# EAGLE design driver_gliderscore (EAGLE 7.5.0)

## Sheet 1 of 2
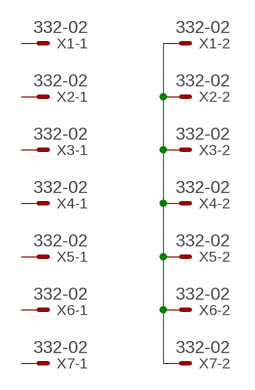
[diagram p0: schematic, sheet 1]

### Parts
X1  332-02  [332-02]
X2  332-02  [332-02]
X3  332-02  [332-02]
X4  332-02  [332-02]
X5  332-02  [332-02]
X6  332-02  [332-02]
X7  332-02  [332-02]

### Nets
N$11: X1.2 X2.2 X3.2 X4.2 X5.2 X6.2 X7.2
Unconnected: X1.1 X2.1 X3.1 X4.1 X5.1 X6.1 X7.1

## Sheet 2 of 2
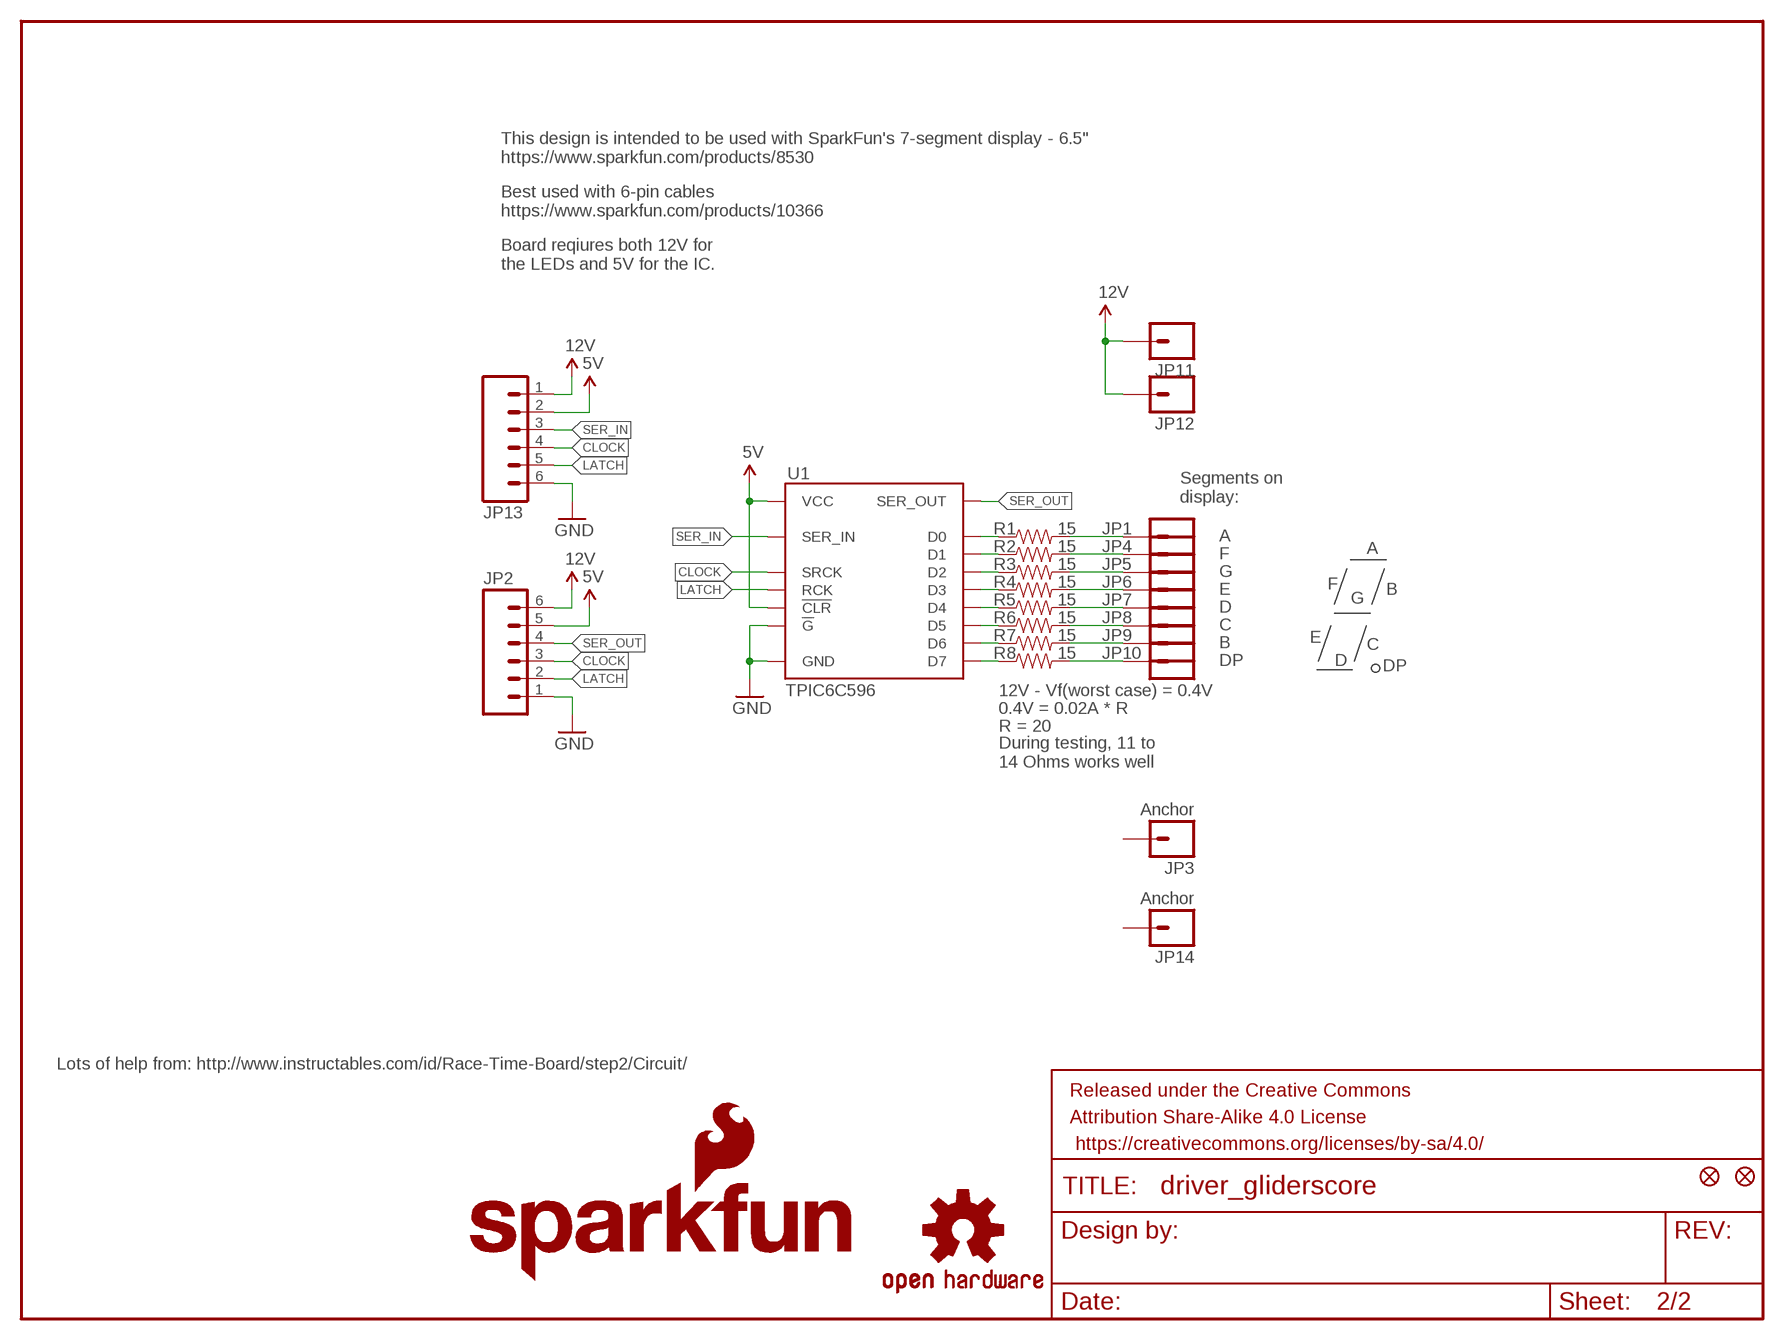
[diagram p1: schematic, sheet 2]

### Parts
FID1  FIDUCIAL1X2  [FIDUCIAL-1X2]
FID2  FIDUCIAL1X2  [FIDUCIAL-1X2]
FRAME1  FRAME-LETTER  [CREATIVE_COMMONS]
JP1  M01PTH_LONGPAD  [1X01_LONGPAD]
JP2  M06SMD  [1X06-SMD]
JP3  Anchor  M01PTH_LONGPAD  [1X01_LONGPAD]
JP4  M01PTH_LONGPAD  [1X01_LONGPAD]
JP5  M01PTH_LONGPAD  [1X01_LONGPAD]
JP6  M01PTH_LONGPAD  [1X01_LONGPAD]
JP7  M01PTH_LONGPAD  [1X01_LONGPAD]
JP8  M01PTH_LONGPAD  [1X01_LONGPAD]
JP9  M01PTH_LONGPAD  [1X01_LONGPAD]
JP10  M01PTH_LONGPAD  [1X01_LONGPAD]
JP11  M01PTH_LONGPAD  [1X01_LONGPAD]
JP12  M01PTH_LONGPAD  [1X01_LONGPAD]
JP13  M06SMD  [1X06-SMD]
JP14  Anchor  M01PTH_LONGPAD  [1X01_LONGPAD]
LOGO1  SFE_LOGO_NAME_FLAME.1_INCH  [SFE_LOGO_NAME_FLAME_.1]
LOGO2  OSHW-LOGOS  [OSHW-LOGO-S]
R1  15  15OHM-1/10W-1%(0603)0603  [0603-RES]
R2  15  15OHM-1/10W-1%(0603)0603  [0603-RES]
R3  15  15OHM-1/10W-1%(0603)0603  [0603-RES]
R4  15  15OHM-1/10W-1%(0603)0603  [0603-RES]
R5  15  15OHM-1/10W-1%(0603)0603  [0603-RES]
R6  15  15OHM-1/10W-1%(0603)0603  [0603-RES]
R7  15  15OHM-1/10W-1%(0603)0603  [0603-RES]
R8  15  15OHM-1/10W-1%(0603)0603  [0603-RES]
U1  TPIC6C596  TPIC6C596SOIC  [SO016]

### Nets
5V: JP2.5 JP13.2 U1.1(VCC) U1.7(!CLR)
12V: JP2.6 JP11.1 JP12.1 JP13.1
CLOCK: JP2.3 JP13.4 U1.15(SRCK)
D0: R1.1 U1.3(D0)
D1: R2.1 U1.4(D1)
D2: R3.1 U1.5(D2)
D3: R4.1 U1.6(D3)
D4: R5.1 U1.11(D4)
D5: R6.1 U1.12(D5)
D6: R7.1 U1.13(D6)
D7: R8.1 U1.14(D7)
GND: JP2.1 JP13.6 U1.8(!G) U1.16(GND)
LATCH: JP2.2 JP13.5 U1.10(RCK)
S0: JP1.1 R1.2
S1: JP4.1 R2.2
S2: JP5.1 R3.2
S3: JP6.1 R4.2
S4: JP7.1 R5.2
S5: JP8.1 R6.2
S6: JP9.1 R7.2
S7: JP10.1 R8.2
SER_IN: JP13.3 U1.2(SER_IN)
SER_OUT: JP2.4 U1.9(SER_OUT)
Unconnected: JP3.1 JP14.1

### Notes on the sheet
- This design is intended to be used with SparkFun's 7-segment display - 6.5"
  https://www.sparkfun.com/products/8530
- Best used with 6-pin cables
  https://www.sparkfun.com/products/10366
- Board reqiures both 12V for 
  the LEDs and 5V for the IC.
- Segments on
  display:
- A
- A
- F
- G
- F
- E | B
- G
- D
- C
- E
- B | C
- DP | D
- DP
- 12V - Vf(worst case) = 0.4V
- 0.4V = 0.02A * R
- R = 20
- During testing, 11 to 
  14 Ohms works well
- Lots of help from: http://www.instructables.com/id/Race-Time-Board/step2/Circuit/

## Library data of the parts
FID1 FID2 = SparkFun-Aesthetics:FIDUCIAL: Fiducial Alignment Points Various fiducial points for machine vision alignment.
FRAME1 = SparkFun-Aesthetics:FRAME-LETTER: Schematic Frame Standard 8.5x11 US Letter frame; DESIGNER: N. Seidle; VERSION: v10
JP1 JP3-JP12 JP14 = SparkFun-Connectors:M01: Header 1 Standard 1-pin 0.1" header. Use with straight break away headers (SKU : PRT-00116), right angle break away headers (PRT-00553), swiss pins (PRT-00743), machine pins (PRT-00117), and female headers (PRT-00115).
JP2 JP13 = SparkFun-Connectors:M06: Header 6 Standard 6-pin 0.1" header. Use with straight break away headers (SKU : PRT-00116), right angle break away headers (PRT-00553), swiss pins (PRT-00743), machine pins (PRT-00117), and female headers (PRT-00115). Molex polarized connector foot print use with SKU : PRT-08094 with associated crimp pins and housings. NOTES ON THE VARIANTS LOCK and LOCK_LONGPADS... This footprint was designed to help hold the alignment of a through-hole component (i.e. 6-pin header) while soldering it into place. You may notice that each hole has been shifted either up or down by 0.005 of an inch from it's more standard position (which is a perfectly straight line). This slight alteration caused the pins (the squares in the middle) to touch the edges of the holes. Because they are alternating, it causes a "brace" to hold the component in place. 0.005 has proven to be the perfect amount of "off-center" position when using our standard breakaway headers. Although looks a little odd when you look at the bare footprint, once you have a header in there, the alteration is very hard to notice. Also,if you push a header all the way into place, it is covered up entirely on the bottom side. This idea of altering the position of holes to aid alignment will be further integrated into the Sparkfun Library for other footprints. It can help hold any component with 3 or more connection pins.; PROD_ID: CONN-08971; VALUE: RA 6Pin SMD
LOGO1 = SparkFun-Aesthetics:SFE_LOGO_NAME_FLAME: SFE Logo, name and flame This is the SparkFun full logo. The logo on the schematic will always be the same size; the package variant is the height of the flame part of the logo. Default layer for the logo on the board is tSilk.
LOGO2 = SparkFun-Aesthetics:OSHW-LOGO: Open Source Hardware Logo This logo indicates the piece of hardware it is found on incorporates a OSHW license and/or adheres to the definition of open source hardware found here: http://freedomdefined.org/OSHW
R1-R8 = SparkFun-Resistors:15OHM-1/10W-1%(0603); PROD_ID: RES-12570
U1 = SparkFun-DigitalIC:TPIC6C596: SMD version of the popular sink driver. This version can sink up to 100mA per channel; PROD_ID: IC-12522
X1-X7 = con-garry:332-02: 2 Pin - 2mm Dual Row Source: www.mpe-connector.de / garry_shortform_2012.pdf

## Board
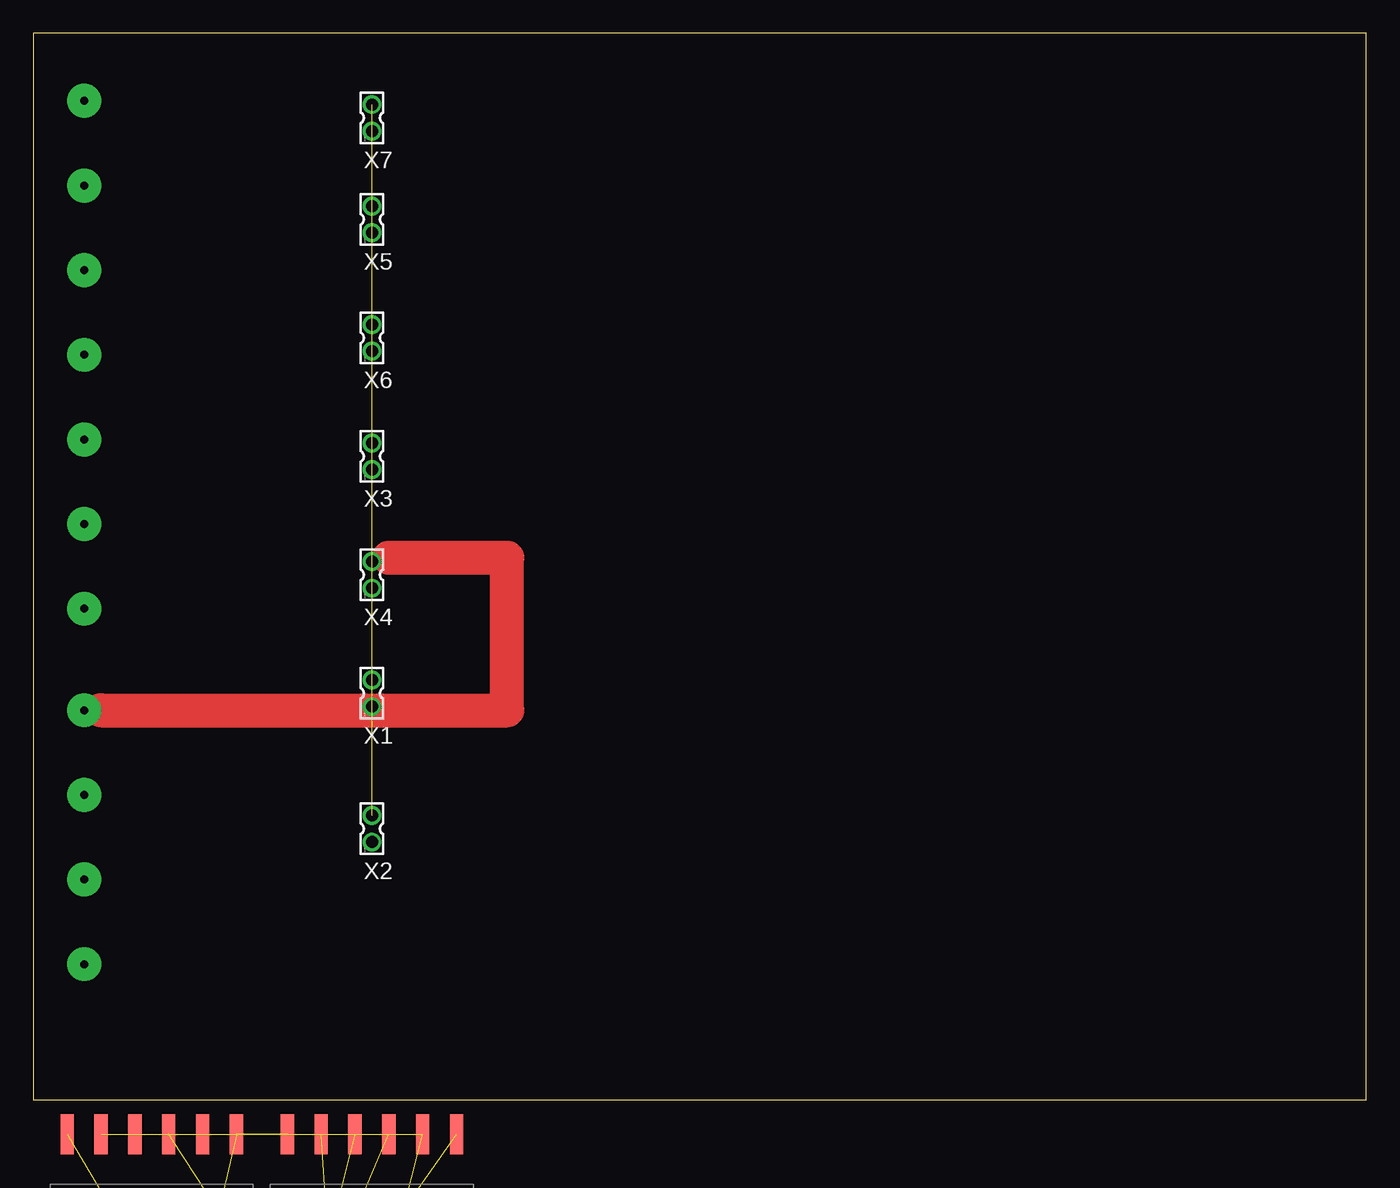
[diagram p2: board, top side]
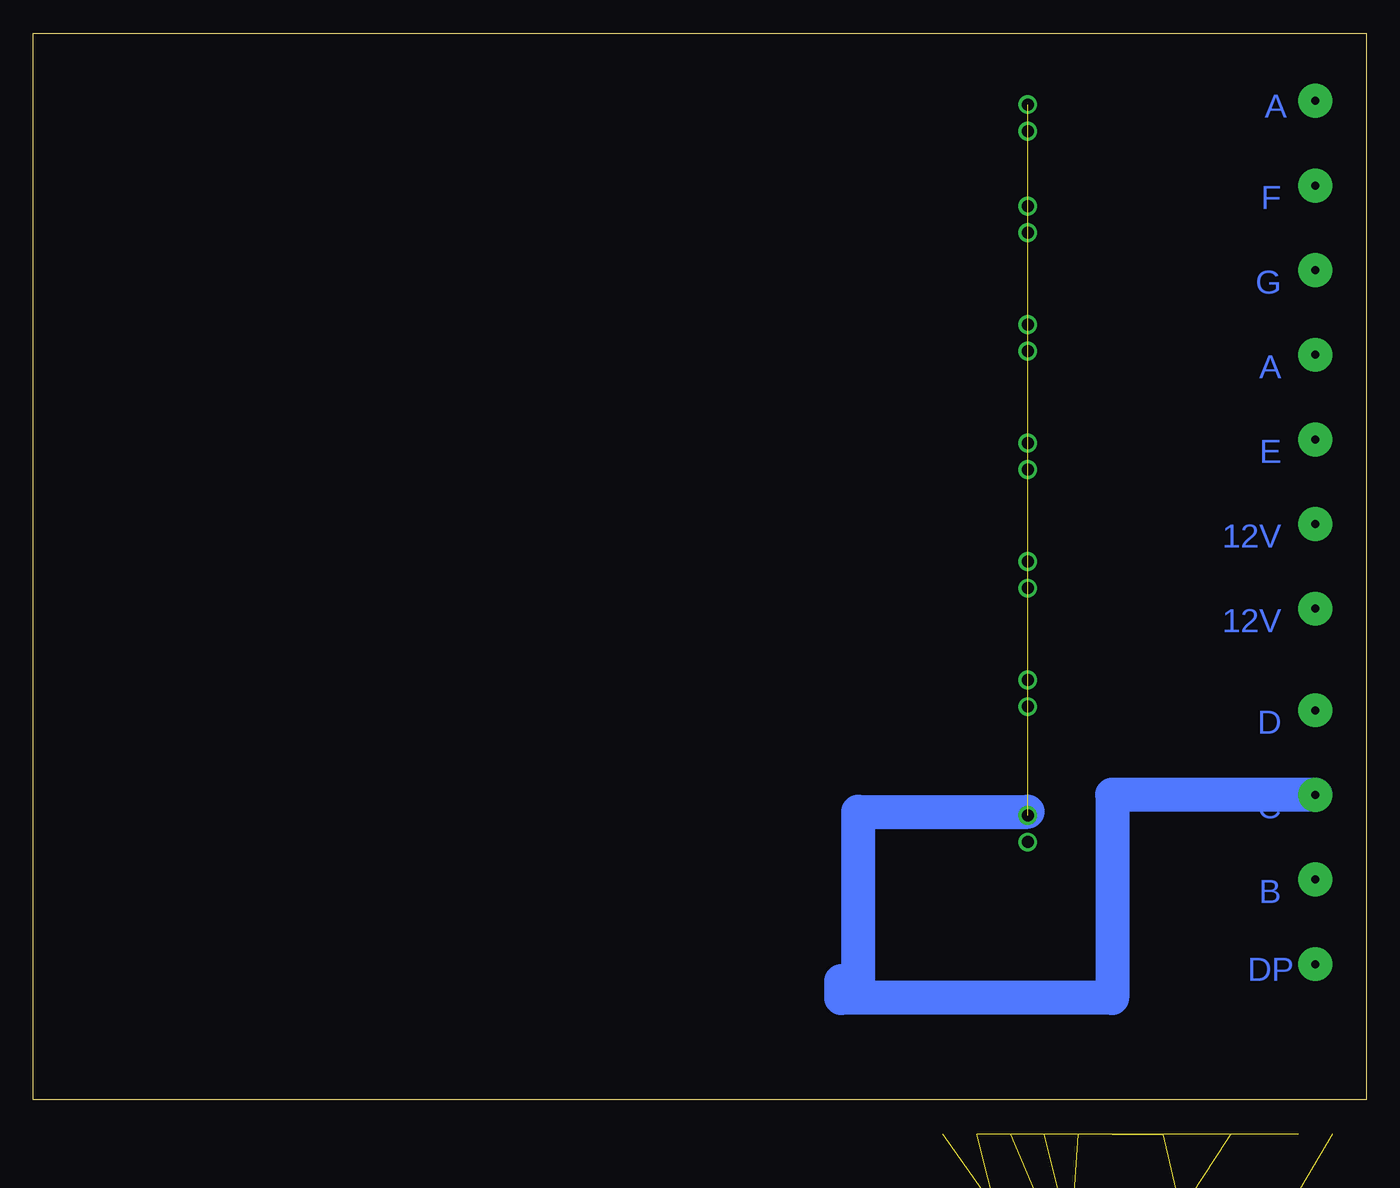
[diagram p3: board, bottom side, seen from below]

Size 100 x 80 mm. Coordinates in mm from the lower left corner, seen from the top.
Outline: 0,0 100,0 100,80 0,80 0,0
Copper layers (1*16): Top 0.035mm / dielectric 1.5mm / Bottom 0.035mm
Design rules "default": minimum track width 10mil, minimum drill 24mil, track to track 8mil, track to pad 8mil, pad to pad 8mil, via to via 8mil, smd to smd 8mil, copper to edge 40mil, drill to drill 8mil, minimum pad ring 10mil, minimum via ring 8mil, stop-mask expansion 4mil, vias tented up to drill 0mil, thermal gap 10mil

### Footprints (pad centres in the part's own frame; a part is rotated, then mirrored left to right if it is on the bottom)
FIDUCIAL-1X2 = smd 1 x 1: 1 0,0
1X01_LONGPAD = drill 1.118 pad 1.88 long: 1 0,0
1X06-SMD = smd 1 x 3: 1 -6.35,5; 2 -3.81,5; 3 -1.27,5; 4 1.27,5; 5 3.81,5; 6 6.35,5 | hole 1.4: -5.08,0; 5.08,0
0603-RES = smd 1.1 x 1: 1 -0.85,0; 2 0.85,0
SO016 = smd 0.6 x 1.2: 1 -4.445,-2.8; 2 -3.175,-2.8; 3 -1.905,-2.8; 4 -0.635,-2.8; 5 0.635,-2.8; 6 1.905,-2.8; 7 3.175,-2.8; 8 4.445,-2.8; 9 4.445,2.8; 10 3.175,2.8; 11 1.905,2.8; 12 0.635,2.8; 13 -0.635,2.8; 14 -1.905,2.8; 15 -3.175,2.8; 16 -4.445,2.8
332-02 = drill 0.9 pad 1.27: 1 0,-1; 2 0,1

### Placement (x,y rotation side)
FID1  29.21,-39.37 0 top  (outside the outline)
FID2  31.75,-39.37 0 top  (outside the outline)
FRAME1  21.59,-22.86 0 top  (outside the outline)
JP1  12.7,-35.56 0 top  (outside the outline)
JP2  8.89,-7.62 0 top
JP3  2.54,-27.94 0 top  (outside the outline)
JP4  16.51,-35.56 0 top  (outside the outline)
JP5  20.32,-35.56 0 top  (outside the outline)
JP6  24.13,-35.56 0 top  (outside the outline)
JP7  27.94,-35.56 0 top  (outside the outline)
JP8  31.75,-35.56 0 top  (outside the outline)
JP9  35.56,-35.56 0 top  (outside the outline)
JP10  41.91,-27.94 0 top  (outside the outline)
JP11  2.54,-35.56 0 top  (outside the outline)
JP12  7.62,-35.56 0 top  (outside the outline)
JP13  25.4,-7.62 0 top
JP14  10.16,-27.94 0 top  (outside the outline)
LOGO1  27.94,-29.21 0 top  (outside the outline)
LOGO2  25.4,-39.37 0 top  (outside the outline)
R1  39.37,-33.02 0 top  (outside the outline)
R2  43.18,-33.02 0 top  (outside the outline)
R3  2.54,-39.37 0 top  (outside the outline)
R4  6.35,-39.37 0 top  (outside the outline)
R5  10.16,-39.37 0 top  (outside the outline)
R6  13.97,-39.37 0 top  (outside the outline)
R7  17.78,-39.37 0 top  (outside the outline)
R8  21.59,-39.37 0 top  (outside the outline)
U1  20.32,-27.94 0 top  (outside the outline)
X1  25.4,30.48 0 top
X2  25.4,20.32 0 top
X3  25.4,48.26 0 top
X4  25.4,39.37 0 top
X5  25.4,66.04 0 top
X6  25.4,57.15 0 top
X7  25.4,73.66 0 top

### Tracks (layer width: path | path; a pad name or v marks a point on that pad's centre or on a via)
5V  (3 unrouted)
12V  (3 unrouted)
A  (via drill 0.6 pad 2.54)
  other vias: 3.81,74.93
CLOCK  (2 unrouted)
D0  (1 unrouted)
D1  (1 unrouted)
D2  (1 unrouted)
D3  (1 unrouted)
D4  (1 unrouted)
D5  (1 unrouted)
D6  (1 unrouted)
D7  (1 unrouted)
F  (via drill 0.6 pad 2.54)
  other vias: 3.81,68.58
GND  (3 unrouted)
LATCH  (2 unrouted)
N$1  (via drill 0.6 pad 2.54)
  other vias: 3.81,10.16
N$2
  Top 2.54: 5.08,29.21 35.56,29.21 35.56,40.64 26.67,40.64
N$3  (via drill 0.6 pad 2.54)
  other vias: 3.81,62.23
N$4  (via drill 0.6 pad 2.54)
  other vias: 3.81,55.88
N$5  (via drill 0.6 pad 2.54)
  other vias: 3.81,49.53
N$6  (via drill 0.6 pad 2.54)
  other vias: 3.81,43.18
N$7  (via drill 0.6 pad 2.54)
  other vias: 3.81,36.83
N$8  (via drill 0.6 pad 2.54)
  other vias: 3.81,29.21
N$9  (via drill 0.6 pad 2.54)
  Bottom 2.54: v3.81,22.86 19.05,22.86 19.05,7.62 39.37,7.62 39.37,8.89 38.1,8.89 38.1,21.59 25.4,21.59
N$10  (via drill 0.6 pad 2.54)
  other vias: 3.81,16.51
N$11  (6 unrouted)
S0  (1 unrouted)
S1  (1 unrouted)
S2  (1 unrouted)
S3  (1 unrouted)
S4  (1 unrouted)
S5  (1 unrouted)
S6  (1 unrouted)
S7  (1 unrouted)
SER_IN  (1 unrouted)
SER_OUT  (1 unrouted)

### Text on the board
Bottom: A | F | G | A | E | 12V | 12V | D | C | B | DP